# Altium schematic sheet RasPiHAT-SOUND.SchDoc
size 409 x 282 mm; >DRAWING_NAME: RasPi-BplusHAT.sch; >LAST_DATE_TIME: 08-Jan-17 10:29:30 AM; >SHEET: 1; Sheet:: Sheet:
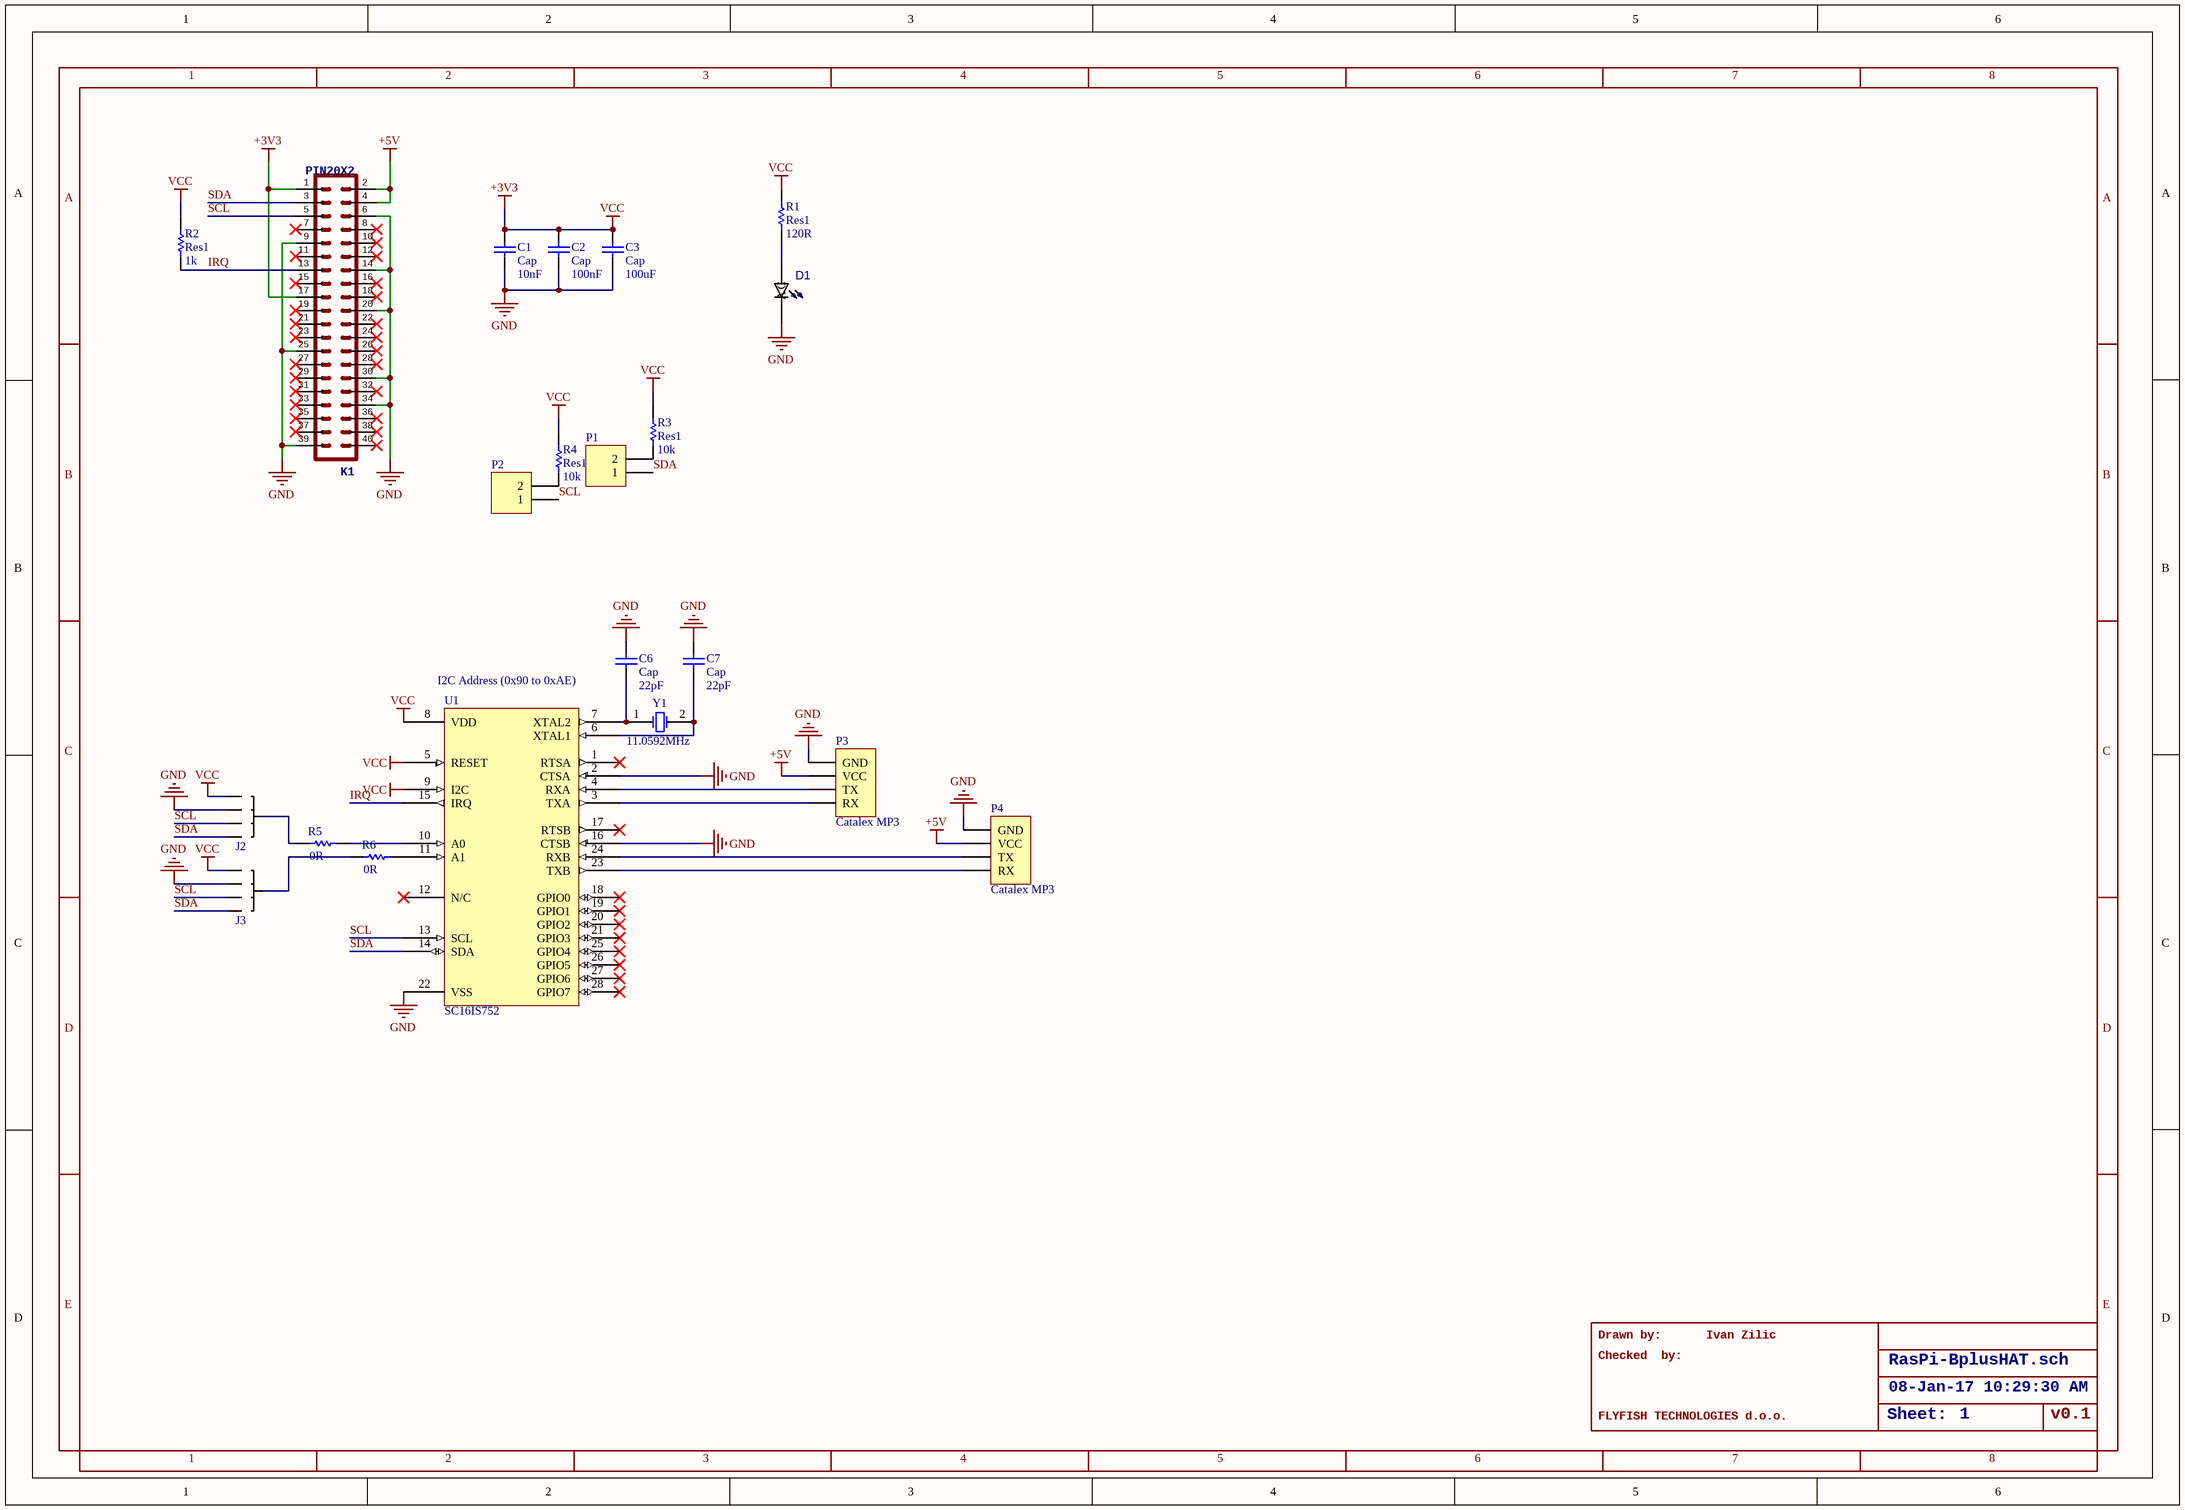
[diagram p0: RasPiHAT-SOUND.SchDoc]

## Parts
C1  Cap  value 10nF  [6-0805_N]
C2  Cap  value 100nF  [6-0805_N]
C3  Cap  value 100uF  [6-0805_N]
C6  Cap  value 22pF  [6-0805_N]
C7  Cap  value 22pF  [6-0805_N]
D1  0805_LED  [LEDSC200X125X70-2N_598-8160-107F(Primary)]  (value not drawn)
J2  Shortable Link (4 Way)  [ShortableLink(4Way)]  (value not drawn)
J3  Shortable Link (4 Way)  [ShortableLink(4Way)]  (value not drawn)
K1  >NAME: K1  [HDR2X20]  (hidden comment: PIN20X2)
P1  Header 2  [HDR1X2]  (value not drawn)
P2  Header 2  [HDR1X2]  (value not drawn)
P3  Catalex MP3  [YX5300_UART]
P4  Catalex MP3  [YX5300_UART]
R1  Res1  value 120R  [6-0805_N]
R2  Res1  value 1k  [6-0805_N]
R3  Res1  value 10k  [6-0805_N]
R4  Res1  value 10k  [6-0805_N]
R5  value 0R  [6-0805_N]  (hidden comment: Res1)
R6  value 0R  [6-0805_N]  (hidden comment: Res1)
U1  SC16IS752
Y1  11.0592MHz  [SMD Crystal]

## Nets
+3V3: C1.2 C2.2 C3.2 J2.5 J3.5 K1.1 K1.17 R1.1 R2.1 R3.1 R4.1 U1.5(RESET) U1.8(VDD) U1.9(I2C)  [also labelled VCC]
+5V: K1.2 K1.4 P3.2(VCC) P4.2(VCC)
GND: C1.1 C2.1 C3.1 C6.1 C7.2 D1.C J2.4 J3.4 K1.6 K1.9 K1.14 K1.20 K1.25 K1.30 K1.34 K1.39 P3.1(GND) P4.1(GND) U1.2(CTSA) U1.16(CTSB) U1.22(VSS)
IRQ: K1.13 R2.2 U1.15(IRQ)
SCL: J2.3 J3.3 K1.5 P2.1 U1.13(SCL)
SDA: J2.2 J3.2 K1.3 P1.1 U1.14(SDA)
NetC6_2: C6.2 U1.7(XTAL2) Y1.1(OSC1)
NetC7_1: C7.1 U1.6(XTAL1) Y1.2(OSC2)
NetD1_A: D1.A R1.2
NetJ2_1: J2.1 R5.1
NetJ3_1: J3.1 R6.1
NetP1_2: P1.2 R3.2
NetP2_2: P2.2 R4.2
NetP3_3: P3.3(TX) U1.4(RXA)
NetP3_4: P3.4(RX) U1.3(TXA)
NetP4_3: P4.3(TX) U1.24(RXB)
NetP4_4: P4.4(RX) U1.23(TXB)
NetR5_2: R5.2 U1.10(A0)
NetR6_2: R6.2 U1.11(A1)

Not connected (* = marked no-connect by the designer): K1 7* 8* 10* 11* 12* 15* 16* 18* 19* 21* 22* 23* 24* 26* 27* 28* 29* 31* 32* 33* 35* 36* 37* 38* 40*; U1 1(RTSA)* 12(N/C)* 17(RTSB)* 18(GPIO0)* 19(GPIO1)* 20(GPIO2)* 21(GPIO3)* 25(GPIO4)* 26(GPIO5)* 27(GPIO6)* 28(GPIO7)*

## Notes on the sheet
- I2C Address (0x90 to 0xAE)
- Drawn by:
- Checked  by:
- Ivan Zilic
- FLYFISH TECHNOLOGIES d.o.o.
- v0.1
- 1
- 2
- 3
- 4
- 5
- 6
- 7
- 8
- A
- B
- C
- D
- E

## Library data of the parts
C1-C3 C6 C7 = Cap: Capacitor; Published: 8-Jun-2000; LatestRevisionDate: 17-Jul-2002; LatestRevisionNote: Re-released for DXP Platform.; PackageReference: RAD-0.3; Publisher: Altium Limited; PackageDescription: Radial Cap, Thru-Hole; 2 Leads; 0.3 in Pin Spacing
D1 = 598-8160-107F: LED, SMD; 0805; Yellow-Green; Water Clear Lens; 40mcd; 570/575nm; MF: Dialight; Package: 0805 Dialight; MP: 598-8160-107F; Price: 0.09 USD; Availability: Good; Value: *
P1 P2 = Header 2: Header, 2-Pin; LatestRevisionDate: 17-Jul-2002; LatestRevisionNote: Re-released for DXP Platform.; Publisher: Altium Limited
P3 P4 = Header 4: Header, 4-Pin; LatestRevisionDate: 17-Jul-2002; LatestRevisionNote: Re-released for DXP Platform.; Publisher: Altium Limited
R1-R6 = Res1: Resistor; Published: 8-Jun-2000; LatestRevisionDate: 17-Jul-2002; LatestRevisionNote: Re-released for DXP Platform.; PackageReference: AXIAL-0.3; Publisher: Altium Limited; PackageDescription: Axial Device, Thru-Hole; 2 Leads; 0.3 in Pin Spacing
U1 = SC16IS752IPW: I2C to UART Interface (2 Channels); Datasheet: http://au.element14.com/nxp/sc16is752ipw-112/dual-uart-fifo-5mbps-3-6v-tssop28/dp/1831259
Y1 = XTAL: Crystal Oscillator; Published: 8-Jun-2000; LatestRevisionDate: 17-Jul-2002; LatestRevisionNote: Re-released for DXP Platform.; PackageReference: R38; Publisher: Altium Limited; PackageDescription: Crystal, Thru-Hole; 2 Leads; Body 3.1 x 8.2 mm (Dia.xH); Datasheet: http://au.element14.com/fox-electronics/foxsdlf-115-20/crystal-11-0592mhz-20pf-hc-49s/dp/2063976
K1 = PIN20X2: >VALUE: PIN20X2